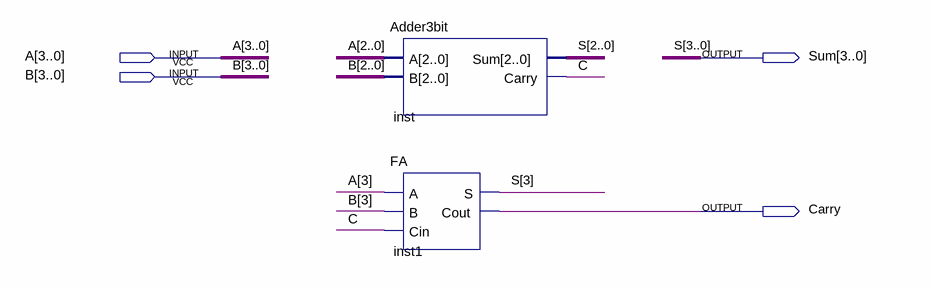
[diagram p0: schematic sheet]
// Quartus schematic Adder4bit.bdf as structural Verilog: 2 symbols, 4 pins
module Adder4bit (
  input  [3:0] A,
  input  [3:0] B,
  output [3:0] Sum,
  output Carry
);

  wire C;

  Adder3bit inst (.A(A[2:0]), .B(B[2:0]), .Sum(Sum[2:0]), .Carry(C));
  FA inst1 (.A(A[3]), .B(B[3]), .Cin(C), .S(Sum[3]), .Cout(Carry));

  // Other names for the same wires on the sheet: S[3:0] = Sum
endmodule
